# Altium schematic sheet MICROCONTROLLER.SchDoc: MICROCONTROLLER
size Letter; Revision: 0.1
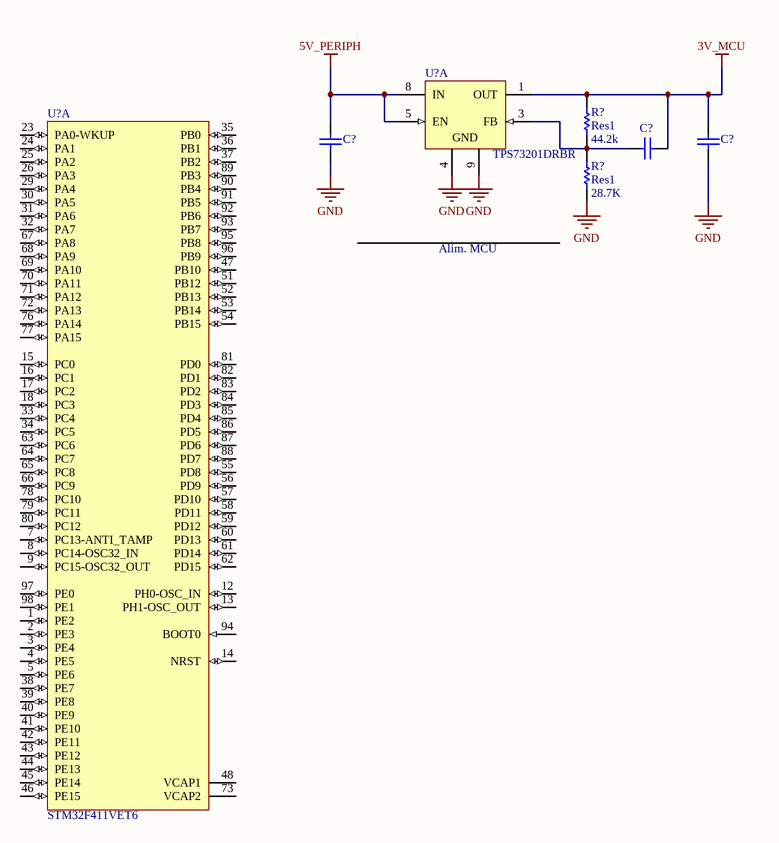
[diagram p0: MICROCONTROLLER.SchDoc]

## Parts
(Parts that share a designator on the sheet are numbered #1, #2 ... from top to bottom, then left to right.)
C?#1  (no value)  [CAPC0603X33X15LL03T05]
C?#2  (no value)  [CAPC1005X55X25LL05T10]
C?#3  (no value)  [CAPC1005X55X25LL05T10]
R?#1  Res1  value 44.2k  [AXIAL-0.3]
R?#2  Res1  value 28.7K  [AXIAL-0.3]
U?#1  TPS73201DRBR  [DRB0008A_V]  (part A of 2)
U?#2  STM32F411VET6  [STM-LQFP100_N]  (part A of 2)

## Nets
3V_MCU: C?#1.2 C?#3.2 R?#1.2 U?#1.1(OUT)
5V_PERIPH: C?#2.2 U?#1.5(EN) U?#1.8(IN)
GND: C?#2.1 C?#3.1 R?#2.1 U?#1.4(GND) U?#1.9(GND)
NetC?#1_1: C?#1.1 R?#1.1 R?#2.2 U?#1.3(FB)

Not connected (* = marked no-connect by the designer): U?#2 1(PE2) 2(PE3) 3(PE4) 4(PE5) 5(PE6) 7(PC13-ANTI_TAMP) 8(PC14-OSC32_IN) 9(PC15-OSC32_OUT) 12(PH0-OSC_IN) 13(PH1-OSC_OUT) 14(NRST) 15(PC0) 16(PC1) 17(PC2) 18(PC3) 23(PA0-WKUP) 24(PA1) 25(PA2) 26(PA3) 29(PA4) 30(PA5) 31(PA6) 32(PA7) 33(PC4) 34(PC5) 35(PB0) 36(PB1) 37(PB2) 38(PE7) 39(PE8) 40(PE9) 41(PE10) 42(PE11) 43(PE12) 44(PE13) 45(PE14) 46(PE15) 47(PB10) 48(VCAP1) 51(PB12) 52(PB13) 53(PB14) 54(PB15) 55(PD8) 56(PD9) 57(PD10) 58(PD11) 59(PD12) 60(PD13) 61(PD14) 62(PD15) 63(PC6) 64(PC7) 65(PC8) 66(PC9) 67(PA8) 68(PA9) 69(PA10) 70(PA11) 71(PA12) 72(PA13) 73(VCAP2) 76(PA14) 77(PA15) 78(PC10) 79(PC11) 80(PC12) 81(PD0) 82(PD1) 83(PD2) 84(PD3) 85(PD4) 86(PD5) 87(PD6) 88(PD7) 89(PB3) 90(PB4) 91(PB5) 92(PB6) 93(PB7) 94(BOOT0) 95(PB8) 96(PB9) 97(PE0) 98(PE1)

## Notes on the sheet
- Alim. MCU
- Title
- Size:
- Date:
- Letter
- Number:
- Time:
- Revision:
- Sheet
- of
- File:

## Library data of the parts
C?#1 = CMP-2010-01291-1: Manufacturer: Murata; Part Number: GRM033R71C331KA01D
C?#2 C?#3 = CMP-2000-06331-1: Chip Capacitor, 0.1 uF, +/- 10%, 10 V, -55 to 125 degC, 0402 (1005 Metric), RoHS, Tape and Reel; Manufacturer: Murata; Rated Voltage: 10V; Capacitance: 100000pF; Dielectric: X7R; Manufacturer URL: http://www.murata.com/; Datasheet Version: 02/2016; Datasheet URL: http://search.murata.co.jp/Ceramy/image/img/A01X/G101/ENG/GRM155R71A104KA01-01.pdf; Package Reference: 0402; Tolerance (%): ±10%; Package Description: 2-Pin Surface Mount Device, Body 1 x 0.5 mm; Mounting Technology: SurfaceMount; Case Size/Dimension: 0402
R?#1 R?#2 = Res1: Resistor; Published: 8-Jun-2000; LatestRevisionDate: 17-Jul-2002; LatestRevisionNote: Re-released for DXP Platform.; PackageReference: AXIAL-0.3; Publisher: Altium Limited; PackageDescription: Axial Device, Thru-Hole; 2 Leads; 0.3 in Pin Spacing
U?#1 = CMP-0394-01311-2: Single Output Fast Transient Response LDO, 250 mA, Adjustable 1.2 to 5.5 V Output, 1.7 to 5.5 V Input, 8-pin SON (DRB), -40 to 85 degC, Green (RoHS & no Sb/Br); Manufacturer: Texas Instruments; SubFamily: Single Channel LDO; Vout Adj(Min)(V): 1.2; Vin(Min)(V): 1.7; Iout(Max)(A): 0.25; Vin(Max)(V): 5.5; Iq(Typ)(mA): 0.4; Accuracy(%): 1; Vdo(Typ)(mV): 40; DatasheetVersion: SBVS037O; ComponentLink3URL: http://www.ti.com/litv/pdf/mpds118h; Mounting Technology: Surface Mount; PackageReference: DRB0008A; ComponentLink2URL: http://www.ti.com/general/docs/lit/getliterature.tsp?genericPartNumber=TPS73201&fileType=pdf; PartNumber: TPS73201DRBR; PackageDescription: 8-Pin Plastic Small Outline, Body 3 x 3 mm, Pitch 0.65 mm; PackageVersion: 4203482-2/K; ComponentLink1URL: http://www.ti.com/; Eco-Plan: Green (RoHS & no Sb/Br); ComponentLink2Description: Datasheet; ComponentLink3Description: Package Specification; ComponentLink1Description: Manufacturer URL; Vout Adj(Max)(V): 5.5
U?#2 = CMP-0243-00174-1: ARM Cortex-M4 32-bit MCU+FPU, 512 KB Flash, 128 KB RAM, 81 I/Os, 100-Pin LQFP, -40 to 85 degC, Tray; Supply Voltage(Vcc) min (V): 1.7; I/Os (High Current): 81; FLASH Size (Prog) (kB): 512; Internal RAM Size (kB): 128; Operating Frequency(F) (Processor speed) (MHz): 100; Packing: Tray; ComponentLink2URL: http://www.st.com/st-web-ui/static/active/en/resource/technical/document/datasheet/DM00115249.pdf; Package Reference: 100-Pin Low Profile Quad Flat Package, Body 14 x 14 mm, Pitch 0.5 mm; ComponentLink2Description: Datasheet; DatasheetVersion: Rev. 6; ComponentLink1Description: Manufacturer URL; Mounting Technology: Surface Mount; Core: ARM Cortex-M4; ComponentLink1URL: http://www.st.com/; Package Description: LQFP100